# Altium schematic sheet 01 Revision History and Contents.SchDoc
size B
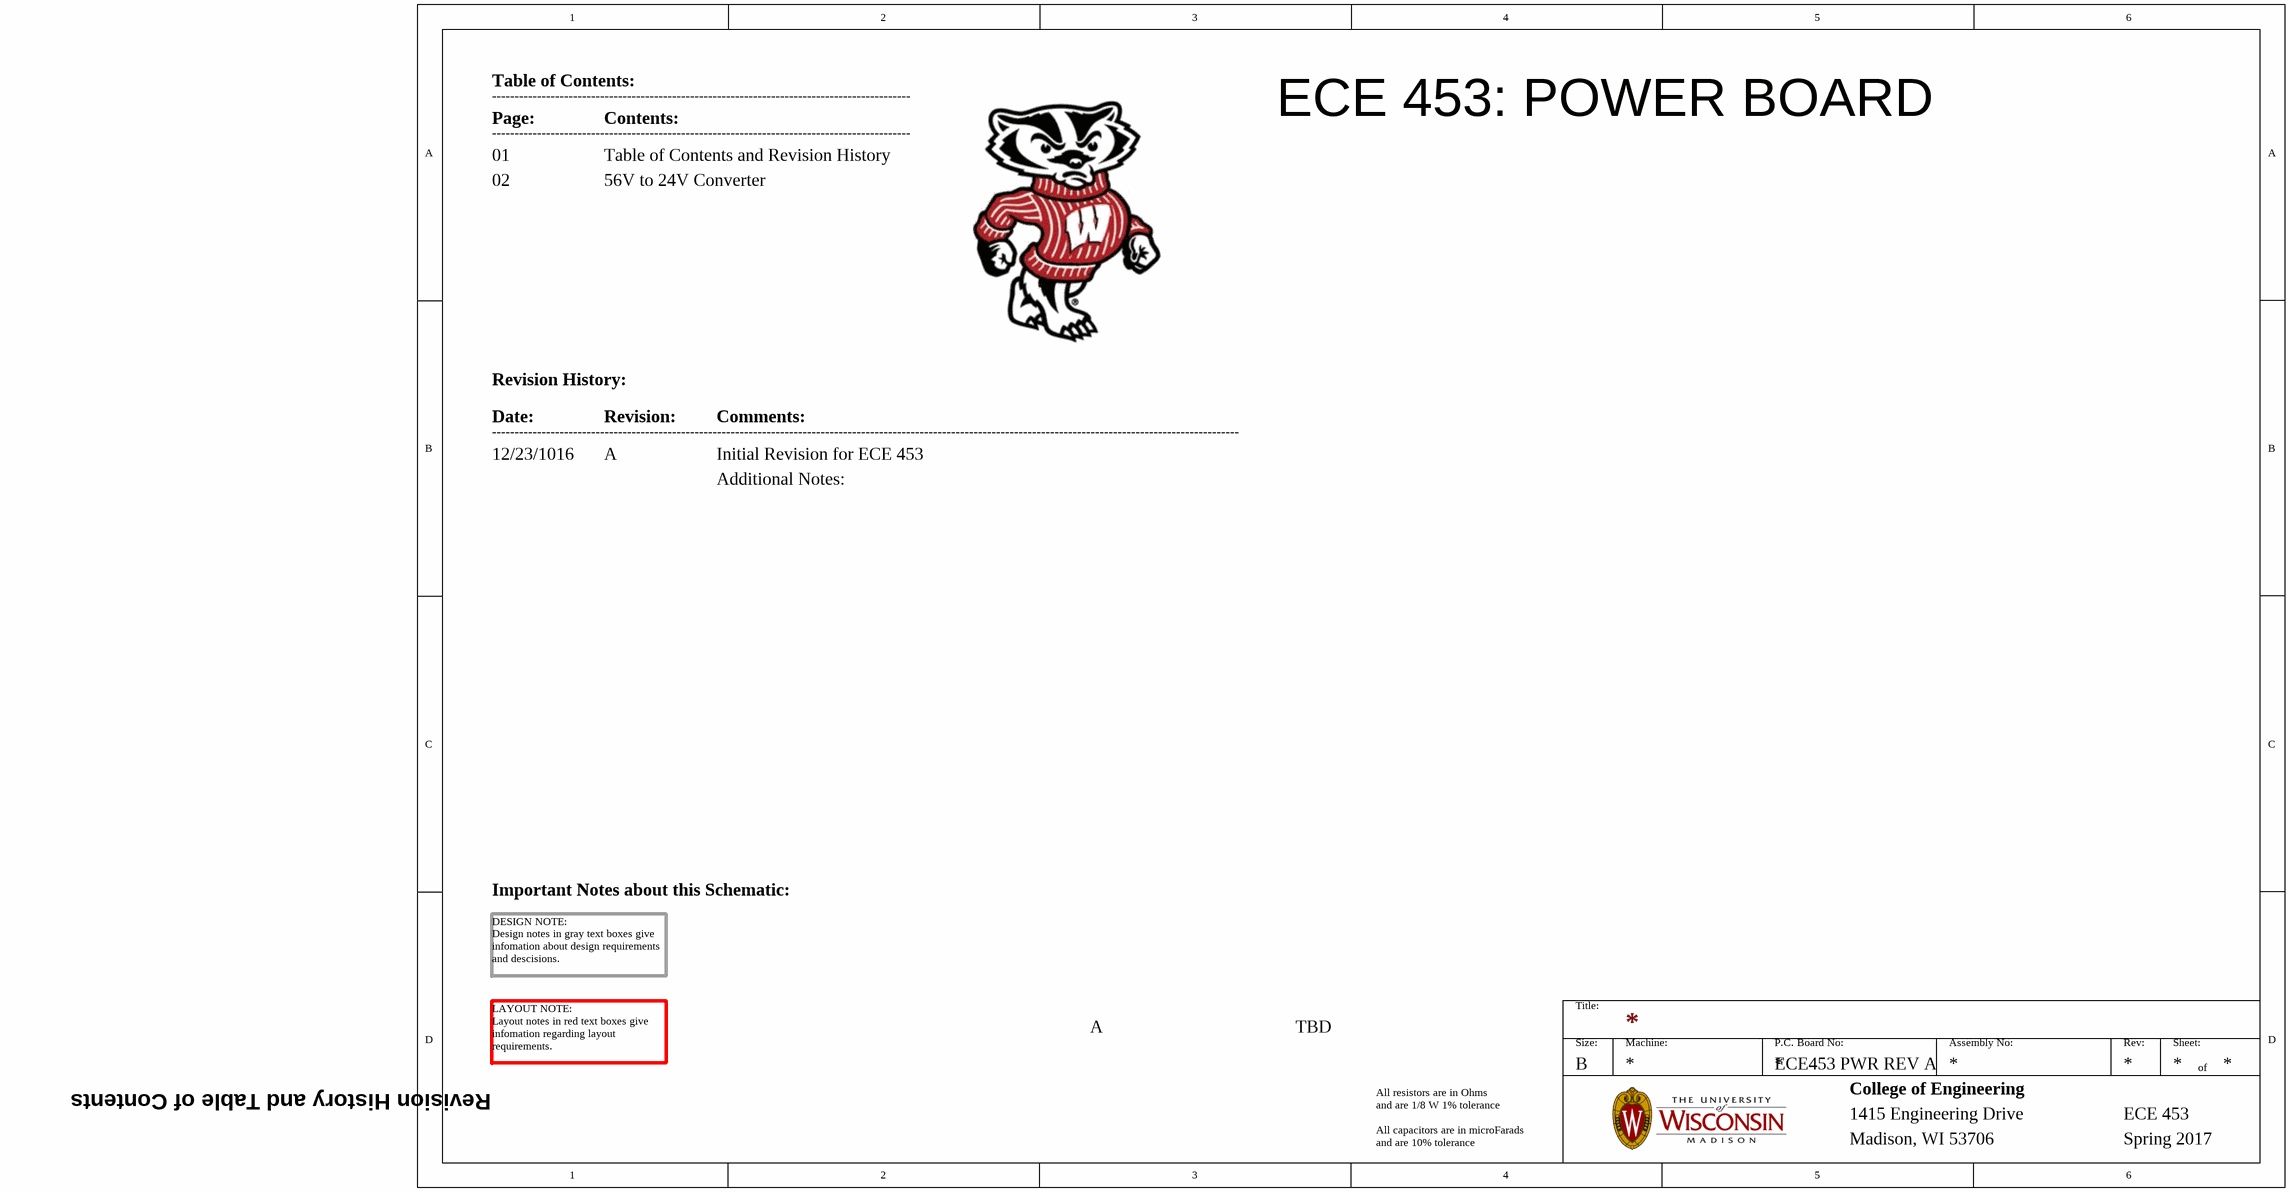
[diagram p0: 01 Revision History and Contents.SchDoc]

## Parts
PCB1  value ECE453 PWR REV A  (hidden comment: PMOD F14 REV A)  (mechanical)

## Notes on the sheet
- Table of Contents:
- Page:
- ---------------------------------------------------------------------------------------------
- Contents:
- ECE 453: POWER BOARD
- 01
- 02
- Table of Contents and Revision History
- 56V to 24V Converter
- Revision History:
- Date:
- 12/23/1016
- ----------------------------------------------------------------------------------------------------------------------------------------------------------------------
- Revision:
- A
- Comments:
- Initial Revision for ECE 453
- Additional Notes:
- Important Notes about this Schematic:
- DESIGN NOTE:
  Design notes in gray text boxes give infomation about design requirements and descisions.
- Revision History and Table of Contents
- LAYOUT NOTE:
  Layout notes in red text boxes give infomation regarding layout requirements.
- TBD
- All resistors are in Ohms
- and are 1/8 W 1% tolerance
- All capacitors are in microFarads
- and are 10% tolerance
- ECE 453
- Spring 2017
- Title:
- Size:
- B
- Machine:
- P.C. Board No:
- Assembly No:
- Rev:
- Sheet:
- of
- College of Engineering
- 1415 Engineering Drive
- Madison, WI 53706

## Library data of the parts
PCB1 = PMOD F14 Rev A Bare PCB: ECE 453 Digital Themometer PMOD F14 Rev A Bare PCB; Manufacturer 1: TBD; Supplier 1: TBD; Supplier Part Number 1: N/A; Manufacturer Part Number 1: PMOD F14 REV A; Supplier Unit Price 1: 33; Package: N/A; Tolerance: N/A; Rating: N/A